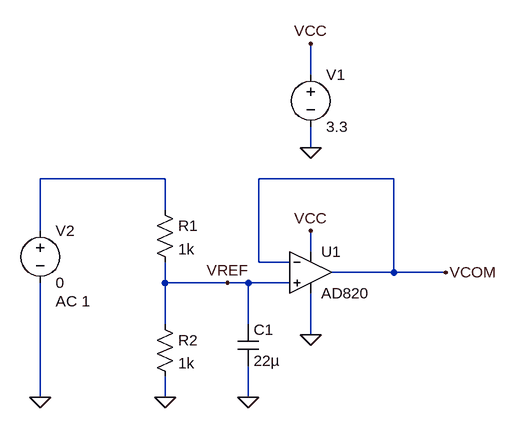
[diagram p0: schematic OPAMP_SIM_ADACUS.asc]
OPAMP_SIM_ADACUS.asc, the LTspice schematic file:
Version 4
SHEET 1 880 680
WIRE 208 -96 208 -144
WIRE 208 16 208 -16
WIRE -16 64 -208 64
WIRE 336 64 128 64
WIRE -16 112 -16 64
WIRE -208 144 -208 64
WIRE 208 176 208 144
WIRE 128 192 128 64
WIRE 176 192 128 192
WIRE 336 208 336 64
WIRE 336 208 240 208
WIRE 416 208 336 208
WIRE -16 224 -16 192
WIRE 80 224 -16 224
WIRE 112 224 80 224
WIRE 176 224 112 224
WIRE -16 288 -16 224
WIRE 112 288 112 224
WIRE 208 304 208 240
WIRE -208 400 -208 224
WIRE -16 400 -16 368
WIRE 112 400 112 352
FLAG 112 400 0
FLAG -16 400 0
FLAG 208 144 VCC
FLAG 208 16 0
FLAG 208 -144 VCC
FLAG 416 208 VCOM
FLAG 80 224 VREF
FLAG 208 304 0
FLAG -208 400 0
SYMBOL OpAmps\\AD820 208 144 R0
SYMATTR InstName U1
SYMBOL res -32 96 R0
SYMATTR InstName R1
SYMATTR Value 1k
SYMBOL res -32 272 R0
SYMATTR InstName R2
SYMATTR Value 1k
SYMBOL cap 96 288 R0
SYMATTR InstName C1
SYMATTR Value 22µ
SYMBOL voltage 208 -112 R0
WINDOW 123 0 0 Left 0
WINDOW 39 0 0 Left 0
SYMATTR InstName V1
SYMATTR Value 3.3
SYMBOL voltage -208 128 R0
WINDOW 123 24 124 Left 2
WINDOW 39 0 0 Left 0
SYMATTR InstName V2
SYMATTR Value 0
SYMATTR Value2 AC 1

The netlist it stands for:
* OPAMP_SIM_ADACUS.asc
XU1 VREF VCOM VCC 0 VCOM AD820  ; pins In+ In- V+ V- OUT
R1 N001 VREF 1k
R2 VREF 0 1k
C1 VREF 0 22µ
V1 VCC 0 3.3
V2 N001 0 0 AC 1
.backanno
.end

* Results of the author's LTspice run, read from the files saved beside the schematic
* Operating Point, zero values left out:
*   V(vcc) = 3.3 V
*   V(vcom) = 703.4 µV
*   I(V1) = -350.1 µA
*   Ix(u1:3) = 350.1 µA
*   Ix(u1:4) = -350.1 µA